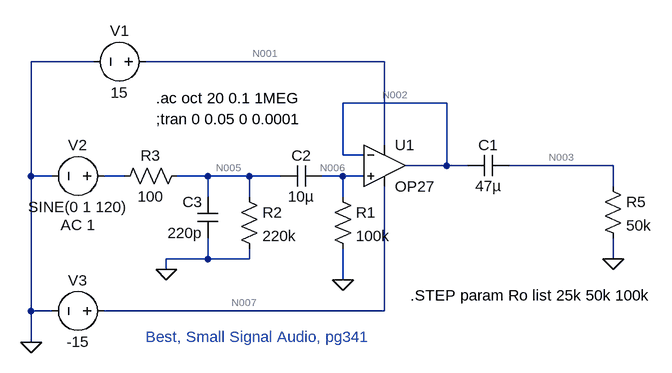
[diagram p0: schematic InputCircuit.asc]
InputCircuit.asc, the LTspice schematic file:
Version 4
SHEET 1 940 680
WIRE -144 -48 -240 -48
WIRE 304 -48 -64 -48
WIRE 400 16 240 16
WIRE 304 80 304 -48
WIRE 240 96 240 16
WIRE 272 96 240 96
WIRE 400 112 400 16
WIRE 400 112 336 112
WIRE 432 112 400 112
WIRE 656 112 496 112
WIRE -240 128 -240 -48
WIRE -208 128 -240 128
WIRE -96 128 -128 128
WIRE 32 128 -16 128
WIRE 96 128 32 128
WIRE 144 128 96 128
WIRE 240 128 208 128
WIRE 272 128 240 128
WIRE 656 144 656 112
WIRE 32 160 32 128
WIRE 96 160 96 128
WIRE 240 160 240 128
WIRE 32 256 32 224
WIRE 32 256 -32 256
WIRE 96 256 96 240
WIRE 96 256 32 256
WIRE 656 256 656 224
WIRE -32 272 -32 256
WIRE 240 288 240 240
WIRE -240 336 -240 128
WIRE -208 336 -240 336
WIRE 304 336 304 144
WIRE 304 336 -128 336
WIRE -240 384 -240 336
FLAG 240 288 0
FLAG -32 272 0
FLAG -240 384 0
FLAG 656 256 0
SYMBOL Opamps\\OP27 304 48 R0
SYMATTR InstName U1
SYMBOL cap 496 96 R90
WINDOW 0 0 32 VBottom 2
WINDOW 3 32 32 VTop 2
SYMATTR InstName C1
SYMATTR Value 47µ
SYMBOL res 224 144 R0
SYMATTR InstName R1
SYMATTR Value 100k
SYMBOL cap 208 112 R90
WINDOW 0 0 32 VBottom 2
WINDOW 3 32 32 VTop 2
SYMATTR InstName C2
SYMATTR Value 10µ
SYMBOL cap 48 224 R180
WINDOW 0 24 56 Left 2
WINDOW 3 24 8 Left 2
SYMATTR InstName C3
SYMATTR Value 220p
SYMBOL res 80 144 R0
SYMATTR InstName R2
SYMATTR Value 220k
SYMBOL res 0 112 R90
WINDOW 0 0 56 VBottom 2
WINDOW 3 32 56 VTop 2
SYMATTR InstName R3
SYMATTR Value 100
SYMBOL voltage -48 -48 R90
WINDOW 0 -32 56 VBottom 2
WINDOW 3 32 56 VTop 2
WINDOW 123 0 0 Left 2
WINDOW 39 0 0 Left 2
SYMATTR InstName V1
SYMATTR Value 15
SYMBOL voltage -112 128 R90
WINDOW 0 -32 56 VBottom 2
WINDOW 3 32 56 VTop 2
WINDOW 123 60 56 VTop 2
WINDOW 39 0 0 Left 2
SYMATTR InstName V2
SYMATTR Value SINE(0 1 120)
SYMATTR Value2 AC 1
SYMBOL voltage -112 336 R90
WINDOW 0 -32 56 VBottom 2
WINDOW 3 32 56 VTop 2
WINDOW 123 0 0 Left 2
WINDOW 39 0 0 Left 2
SYMATTR InstName V3
SYMATTR Value -15
SYMBOL res 640 128 R0
SYMATTR InstName R5
SYMATTR Value 50k
TEXT -48 8 Left 2 !.ac oct 20 0.1 1MEG
TEXT -48 40 Left 2 !;tran 0 0.05 0 0.0001
TEXT -64 376 Left 2 ;Best, Small Signal Audio, pg341
TEXT 344 312 Left 2 !.STEP param Ro list 25k 50k 100k

The netlist it stands for:
* InputCircuit.asc
XU1 N006 N002 N001 N007 N002 OP27  ; pins In+ In- V+ V- OUT
C1 N003 N002 47µ
R1 N006 0 100k
C2 N006 N005 10µ
C3 0 N005 220p
R2 N005 0 220k
R3 N005 N004 100
V1 N001 0 15
V2 N004 0 SINE(0 1 120) AC 1
V3 N007 0 -15
R5 N003 0 50k
.ac oct 20 0.1 1MEG
;tran 0 0.05 0 0.0001
* Best, Small Signal Audio, pg341
.STEP param Ro list 25k 50k 100k
.lib ADI.lib
.backanno
.end

* Results of the author's LTspice run, read from the files saved beside the schematic
* Operating Point (first step), zero values left out:
*   ro = 25 k
*   V(n001) = 15 V
*   V(n007) = -15 V
*   I(V3) = 2.666 mA
*   I(V1) = -2.666 mA
*   Ix(u1:3) = 2.666 mA
*   Ix(u1:4) = -2.666 mA
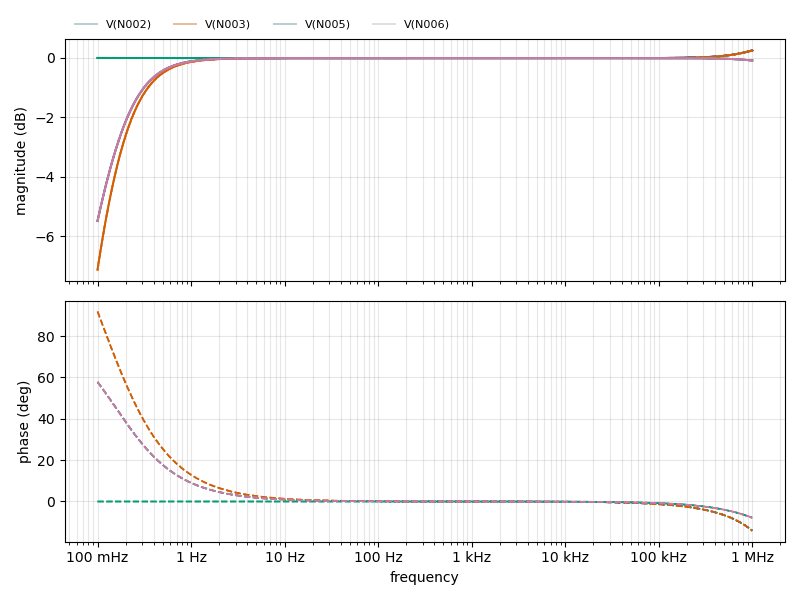
[diagram p1: AC Analysis of InputCircuit.asc, plotted from the saved traces]
* AC Analysis, 3 runs:
*   V(N002) [ro=25000]: -5.49 dB at 100 mHz, 0.25 dB at 1 MHz, peak 0.25 dB at 1 MHz, 3 dB below the peak at 169.1 mHz
*   V(N002) [ro=50000]: -5.49 dB at 100 mHz, 0.25 dB at 1 MHz, peak 0.25 dB at 1 MHz, 3 dB below the peak at 169.1 mHz
*   V(N002) [ro=100000]: -5.49 dB at 100 mHz, 0.25 dB at 1 MHz, peak 0.25 dB at 1 MHz, 3 dB below the peak at 169.1 mHz
*   V(N003) [ro=25000]: -7.13 dB at 100 mHz, 0.25 dB at 1 MHz, peak 0.25 dB at 1 MHz, 3 dB below the peak at 193.1 mHz
*   V(N003) [ro=50000]: -7.13 dB at 100 mHz, 0.25 dB at 1 MHz, peak 0.25 dB at 1 MHz, 3 dB below the peak at 193.1 mHz
*   V(N003) [ro=100000]: -7.13 dB at 100 mHz, 0.25 dB at 1 MHz, peak 0.25 dB at 1 MHz, 3 dB below the peak at 193.1 mHz
*   V(N005) [ro=25000]: -0.01 dB at 100 mHz, -0.09 dB at 1 MHz, peak -0.01 dB at 100 mHz
*   V(N005) [ro=50000]: -0.01 dB at 100 mHz, -0.09 dB at 1 MHz, peak -0.01 dB at 100 mHz
*   V(N005) [ro=100000]: -0.01 dB at 100 mHz, -0.09 dB at 1 MHz, peak -0.01 dB at 100 mHz
*   V(N006) [ro=25000]: -5.49 dB at 100 mHz, -0.09 dB at 1 MHz, peak -0.01 dB at 1.081 kHz, 3 dB below the peak at 159 mHz
*   V(N006) [ro=50000]: -5.49 dB at 100 mHz, -0.09 dB at 1 MHz, peak -0.01 dB at 1.081 kHz, 3 dB below the peak at 159 mHz
*   V(N006) [ro=100000]: -5.49 dB at 100 mHz, -0.09 dB at 1 MHz, peak -0.01 dB at 1.081 kHz, 3 dB below the peak at 159 mHz